# Altium schematic sheet Hydrated_Buffs.SchDoc
size A
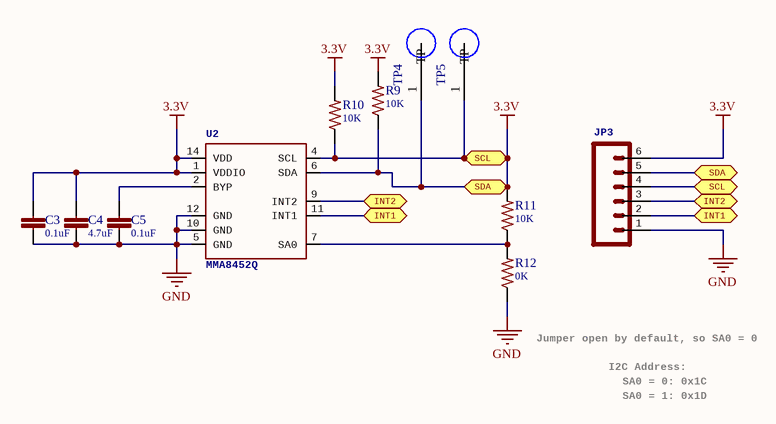
[diagram p0: Hydrated_Buffs.SchDoc]

## Parts
C3  value 0.1uF  (hidden comment: Cap0.1uF)
C4  value 4.7uF  (hidden comment: Cap4.7uF)
C5  value 0.1uF  (hidden comment: Cap0.1uF)
JP3  M06SIP  [1X06]  (value not drawn)
R9  value 10K  (hidden comment: Res10K)
R10  value 10K  (hidden comment: Res10K)
R11  value 10K  (hidden comment: Res10K)
R12  value 0K  (hidden comment: Res0K)
TP4  5019  [*TP380X203]  (value not drawn)
TP5  5019  [*TP380X203]  (value not drawn)
U2  MMA8452Q  [QFN-16_0.5MM]

## Ports
INT1, INT2, SCL, SDA

## Nets
3.3V: C3.1 C4.1 JP3.4 JP3.5 JP3.6 R9.1 R9.2 R10.1 R10.2 R11.2 TP4.1(TP) TP5.1(TP) U2.1(VDDIO) U2.4(SCL) U2.6(SDA) U2.14(VDD) ; port SCL, port SDA
GND: C3.2 C4.2 C5.2 JP3.1 R12.1 U2.5(GND) U2.10(GND) U2.12(GND)
INT1: JP3.2 U2.11(INT1) ; port INT1
INT2: JP3.3 U2.9(INT2) ; port INT2
NetC5_1: C5.1 U2.2(BYP)
NetR11_1: R11.1 R12.2 U2.7(SA0)

## Notes on the sheet
- (near R12) Jumper open by default, so SA0 = 0
- I2C Address:
- SA0 = 0: 0x1C
- SA0 = 1: 0x1D

## Library data of the parts
JP3 = M06SIP: Header 6Standard 6-pin 0.1" header. Use with straight break away headers (SKU : PRT-00116), right angle break away headers (PRT-00553), swiss pins (PRT-00743), machine pins (PRT-00117), and female headers (PRT-00115). Molex polarized connector foot print use with SKU : PRT-08094 with associated crimp pins and housings. NOTES ON THE VARIANTS LOCK and LOCK_LONGPADS... This footprint was designed to help hold the alignment of a through-hole component (i.e.  6-pin header) while soldering it into place. You may notice that each hole has been shifted either up or down by 0.005 of an inch from it's more standard position (which is a perfectly straight line). This slight alteration caused the pins (the squares in the middle) to touch the edges of the holes.  Because they are alternating, it causes a "brace" to hold the component in place.  0.005 has proven to be the perfect amount of "off-center" position when using our standard breakaway headers. Although looks a little odd when you look at the bare footprint, once you have a header in there, the alteration is very hard to notice.  Also, if you push a header all the way into place, it is covered up entirely on the bottom side.  This idea of altering the position of holes to aid alignment will be further integrated into the Sparkfun Library for other footprints.  It can help hold any component with 3 or more connection pins.
TP4 TP5 = 5019: Phosphor Bronze Contact Miniature Silver Plated Surface Mount Test Points; MF: Keystone Electronics; Package: 2010 Keystone; Price: None; Availability: Unavailable; MP: 5019; SnapEDA_Link: https://www.snapeda.com/parts/5019/Keystone%20Electronics/view-part/?ref=snap; Value: *
U2 = MMA8452Q: MMA8452Q 3-Axis, 12/8-bit Digital Accelerometer  Supply Voltage: 1.6-3.6V  Range: +/- 2g, 4g, 8g  Interface: I2C, 12-bit and 8-bit  ODR: 1.56 Hz - 800 Hz  Package: QFN-16      http://cache.freescale.com/files/sensors/doc/data_sheet/MMA8452Q.pdf